# Altium schematic sheet 39_PP1_DDR.SchDoc
size 419 x 296 mm; Author: Serbinov O.A.; CompanyName: ELSICOM; DrawnBy: Serbinov O.A.; Engineer: Serbinov O.A.; Organization: Elsicom; Address1: Kirova avenue, 58; Address2: Tomsk; Address3: Russia 634012; DocumentNumber: 40; SheetNumber: 40; SheetTotal: 44; ProjectName: 48_PORTS
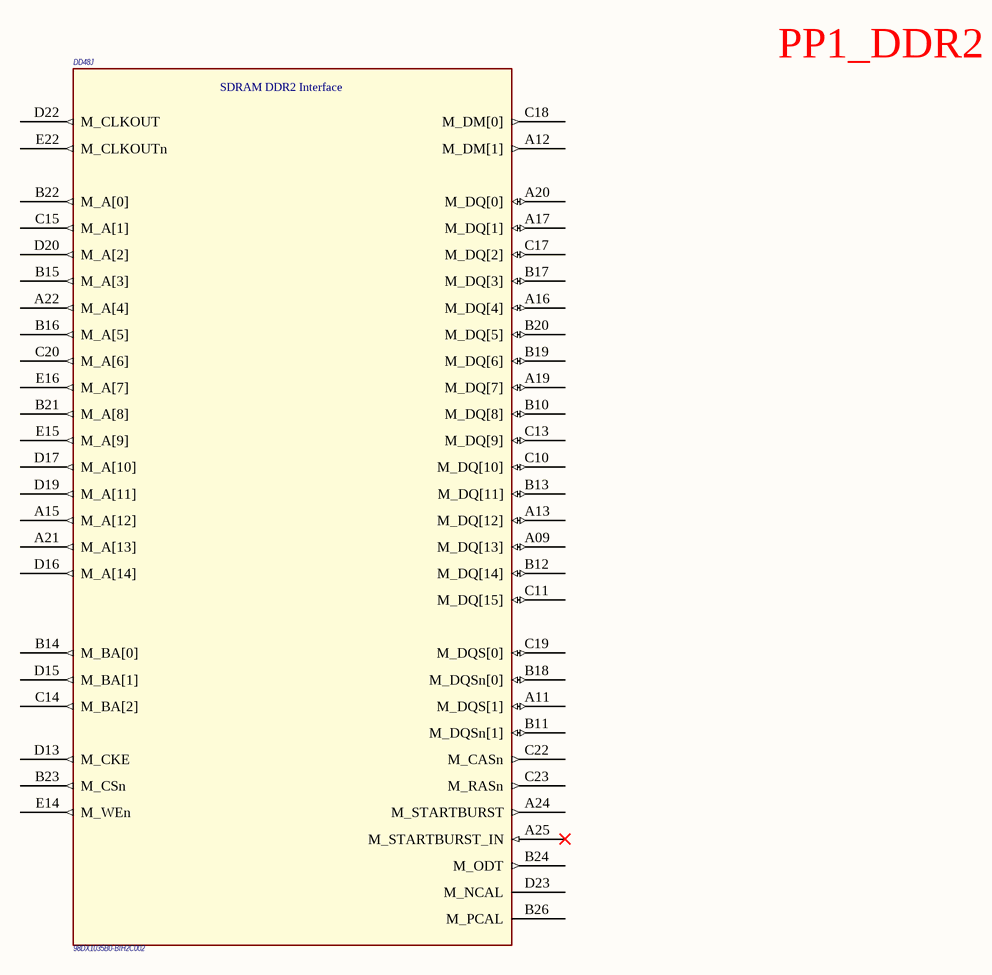
[diagram p0: 39_PP1_DDR.SchDoc]

## Parts
DD48  98DX1035B0-BIH2C002  [HSBGA617_27X27_1MM]  (part J of 16)

## Nets

Not connected (* = marked no-connect by the designer): DD48 A09(M_DQ[13]) A11(M_DQS[1]) A12(M_DM[1]) A13(M_DQ[12]) A15(M_A[12]) A16(M_DQ[4]) A17(M_DQ[1]) A19(M_DQ[7]) A20(M_DQ[0]) A21(M_A[13]) A22(M_A[4]) A24(M_STARTBURST) A25(M_STARTBURST_IN)* B10(M_DQ[8]) B11(M_DQSn[1]) B12(M_DQ[14]) B13(M_DQ[11]) B14(M_BA[0]) B15(M_A[3]) B16(M_A[5]) B17(M_DQ[3]) B18(M_DQSn[0]) B19(M_DQ[6]) B20(M_DQ[5]) B21(M_A[8]) B22(M_A[0]) B23(M_CSn) B24(M_ODT) B26(M_PCAL) C10(M_DQ[10]) C11(M_DQ[15]) C13(M_DQ[9]) C14(M_BA[2]) C15(M_A[1]) C17(M_DQ[2]) C18(M_DM[0]) C19(M_DQS[0]) C20(M_A[6]) C22(M_CASn) C23(M_RASn) D13(M_CKE) D15(M_BA[1]) D16(M_A[14]) D17(M_A[10]) D19(M_A[11]) D20(M_A[2]) D22(M_CLKOUT) D23(M_NCAL) E14(M_WEn) E15(M_A[9]) E16(M_A[7]) E22(M_CLKOUTn)

## Notes on the sheet
- PP1_DDR2
- A3
- SIZE
- PROJECT
- SHEET
- OF
- Engineer: Oleg Serbinov
- (in symbol 98DX1035A1-BIH2C002, part J) SDRAM DDR2 Interface

## Library data of the parts
DD48 = 98DX1035A1-BIH2C002: IC 24-PORT FE  4-PORT 2.5GE L2 ENTRY-LEVEL, CPU; Customer Part Number: Микросхема, 98DX1035B0-BIH2C002, IC 24-PORT FE 4-PORT 2.5GE L2 ENTRY-LEVEL, HSBGA617SBGA617; Manufacturer: Marvell Technology Group; Manufacturer Part Number: 98DX1035B0-BIH2C002